# EAGLE schematic Pi_Tracker1 (EAGLE 6.5.0)
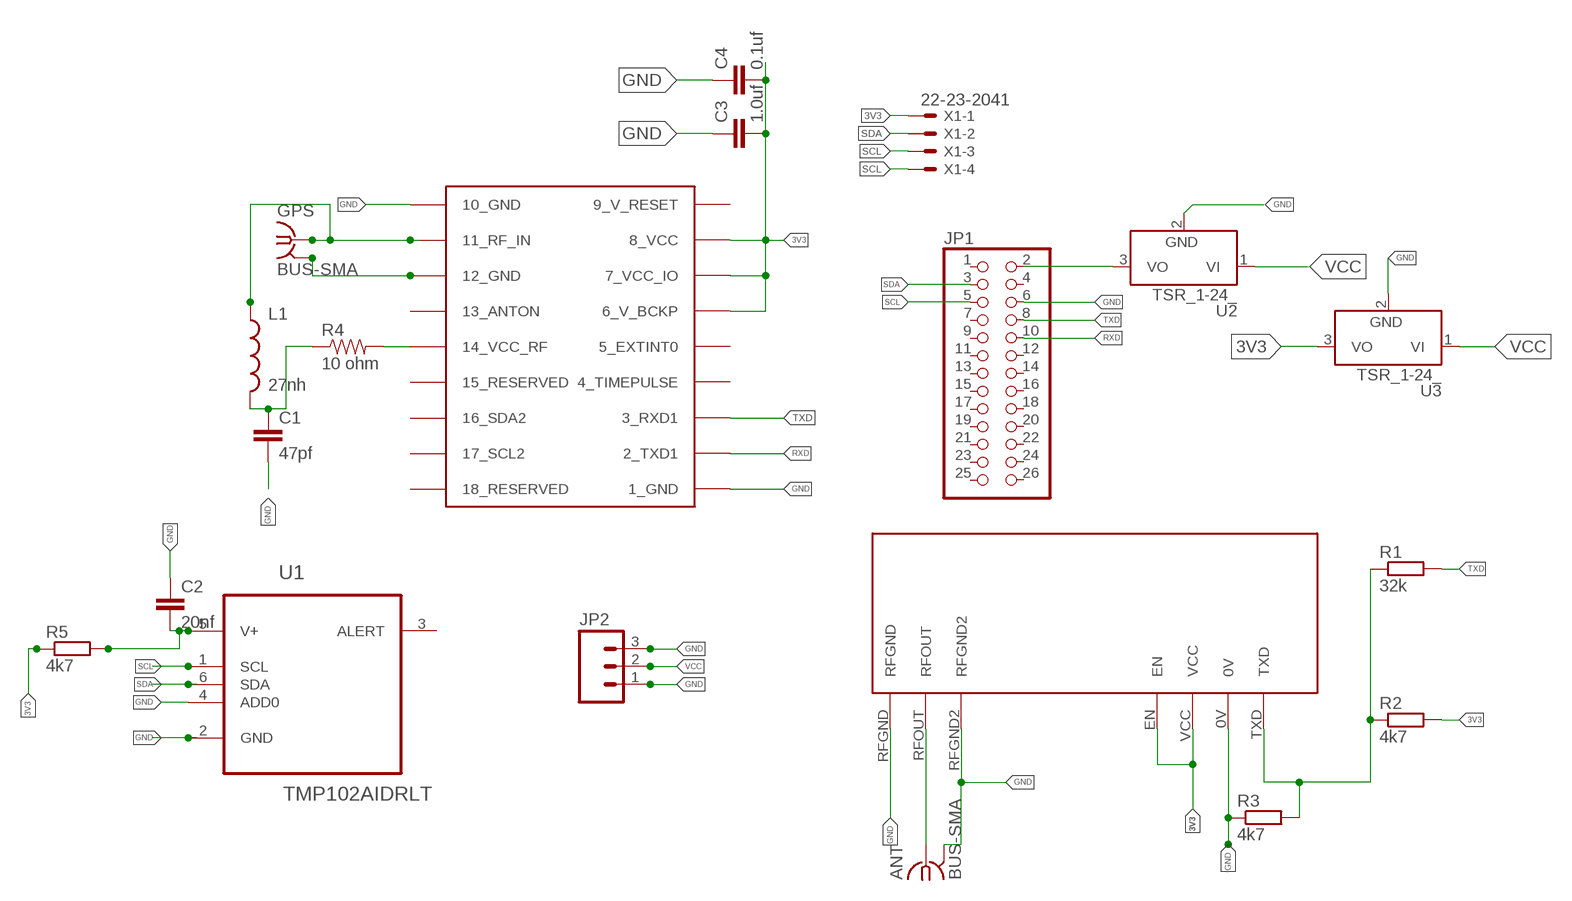
[diagram p0: schematic, sheet 1]

## Parts
ANT  BUS-SMA  [BUS-SMA]
C1  47pf  CAP0603-CAP  [0603-CAP]
C2  20nf  C-EUC0603  [C0603]
C3  1.0uf  C-EUC0603  [C0603]
C4  0.1uf  C-EUC0603  [C0603]
GPS  BUS-SMA  [BUS-SMA]
JP1  PINHD-2X13  [2X13]
JP2  M03PTH  [1X03]
L1  27nh  INDUCTOR0603  [0603]
R1  32k  R-EU_R0603  [R0603]
R2  4k7  R-EU_R0603  [R0603]
R3  4k7  R-EU_R0603  [R0603]
R4  10 ohm  RESISTOR0603  [0603-RES]
R5  4k7  R-EU_R0603  [R0603]
U1  TMP102AIDRLT  [SOT50P160X60-6N]
U2  TSR_1-24_  [TSR-1]
U3  TSR_1-24_  [TSR-1]
U$1  NTX2  [NTX2]
U$2  UBLOX_MAX  [UBLOX_MAX]
X1  22-23-2041  [22-23-2041]

## Nets
3V3: C2.2 C3.2 C4.2 R2.2 R5.1 R5.2 U1.5(V+) U3.3(VO) U$1.EN U$1.VCC U$2.6_V_BCKP U$2.7_VCC_IO U$2.8_VCC X1.1
GND: ANT.2(GND) ANT.3(GND) ANT.4(GND) ANT.5(GND) C1.2 C2.1 C3.1 C4.1 GPS.2(GND) GPS.3(GND) GPS.4(GND) GPS.5(GND) JP1.6 JP2.1 JP2.3 R3.1 U1.2(GND) U1.4(ADD0) U2.2(GND) U3.2(GND) U$1.0V U$1.RFGND U$1.RFGND2 U$2.1_GND U$2.10_GND U$2.12_GND X1.4
N$2: R4.2 U$2.14_VCC_RF
N$3: C1.1 L1.2 R4.1
N$6: R1.1 R2.1 R3.2 U$1.TXD
N$7: JP1.2 U2.3(VO)
N$9: ANT.1 U$1.RFOUT
N$13: GPS.1 L1.1 U$2.11_RF_IN
RXD: JP1.10 U$2.2_TXD1
SCL: JP1.5 U1.1(SCL) X1.3
SDA: JP1.3 U1.6(SDA) X1.2
TXD: JP1.8 R1.2 U$2.3_RXD1
VCC: JP2.2 U2.1(VI) U3.1(VI)
Unconnected: JP1.1 JP1.4 JP1.7 JP1.9 JP1.11 JP1.12 JP1.13 JP1.14 JP1.15 JP1.16 JP1.17 JP1.18 JP1.19 JP1.20 JP1.21 JP1.22 JP1.23 JP1.24 JP1.25 JP1.26 U1.3(ALERT) U$2.4_TIMEPULSE U$2.5_EXTINT0 U$2.13_ANTON U$2.15_RESERVED U$2.16_SDA2 U$2.17_SCL2 U$2.18_RESERVED

## Power pins joined to a net without a drawn wire
9_V_RESET: U$2.9_V_RESET

## Library data of the parts
ANT GPS = Ava:BUS-SMA
C1 = SparkFun-Capacitors:CAP: Capacitor Standard 0603 ceramic capacitor, and 0.1" leaded capacitor.
C2-C4 = rcl:C-EU: CAPACITOR, European symbol
JP1 = pinhead:PINHD-2X13: PIN HEADER
JP2 = SparkFun-Connectors:M03: Header 3 Standard 3-pin 0.1" header. Use with straight break away headers (SKU : PRT-00116), right angle break away headers (PRT-00553), swiss pins (PRT-00743), machine pins (PRT-00117), and female headers (PRT-00115). Molex polarized connector foot print use with SKU : PRT-08232 with associated crimp pins and housings.
L1 = SparkFun-Passives:INDUCTOR: Inductors Basic Inductor/Choke - 0603 and 1206. Footprints are not proven and vary greatly between part numbers. SRN6045- 33uH, 20% 1.4A SDR0403-560KL - 56uH, 10%, 500mA RMS/740mA peak
R1-R3 R5 = rcl:R-EU_: RESISTOR, European symbol
R4 = SparkFun-Resistors:RESISTOR: Resistor Basic schematic elements and footprints for 0603, 1206, and PTH resistors.
U1 = Ava:TMP102AIDRLT: Temperature Sensor; MPN: TMP102AIDRLT; OC_FARNELL: 1652477; OC_NEWARK: 53M3987; PACKAGE: SOT-23-6; SUPPLIER: Texas Instruments
U2 U3 = traco_tsr-1:TSR_1-*: TRACO TSR-1 Series Point-of-Load DC/DC-Converters Vi max. 36 V; Vo = (1.2 .. 15)V ±2%; Io = 0 .. 1 A SIP-Package (drop-in replacement for 78xx linear voltage regulators in TO220-package, vertically assembled) Source: www.tracopower.com Technologies: TSR 1- Vi (V) Vo (V) ±2% Io = 0 .. 1 A 24_ ( generic ) 2412 4.6 .. 36 1.2 2415 4.6 .. 36 1.5 2418 4.6 .. 36 1.8 2425 4.6 .. 36 2.5 2433 4.75.. 36 3.3 2450 6.5 .. 36 5.0 2465 9.0 .. 36 6.5 2490 12 .. 36 9.0 24120 15 .. 36 12 24150 18 .. 36 15 Author: Dipl.-Ing. FH Rainer Bayer HHN Hochschule Heilbronn, rainer.bayer@hs-heilbronn.de IngenieurbÃ¼ro ing-rb, mail@ing-rb.de
U$1 = Ava:NTX2: Radiometrix NTX2 Transmitter Module Author Anthony Stirk / http://ava.upuaut.net
U$2 = Ava:UBLOX_MAX: UBLOX MAX
X1 = con-molex:22-23-2041: .100" (2.54mm) Center Header - 4 Pin; MF: MOLEX; MPN: 22-23-2041; OC_FARNELL: 1462920; OC_NEWARK: 38C0355

## Net classes
0 default: clearance 0.205 mm